# EAGLE design tft_jig (EAGLE 9.3.2)
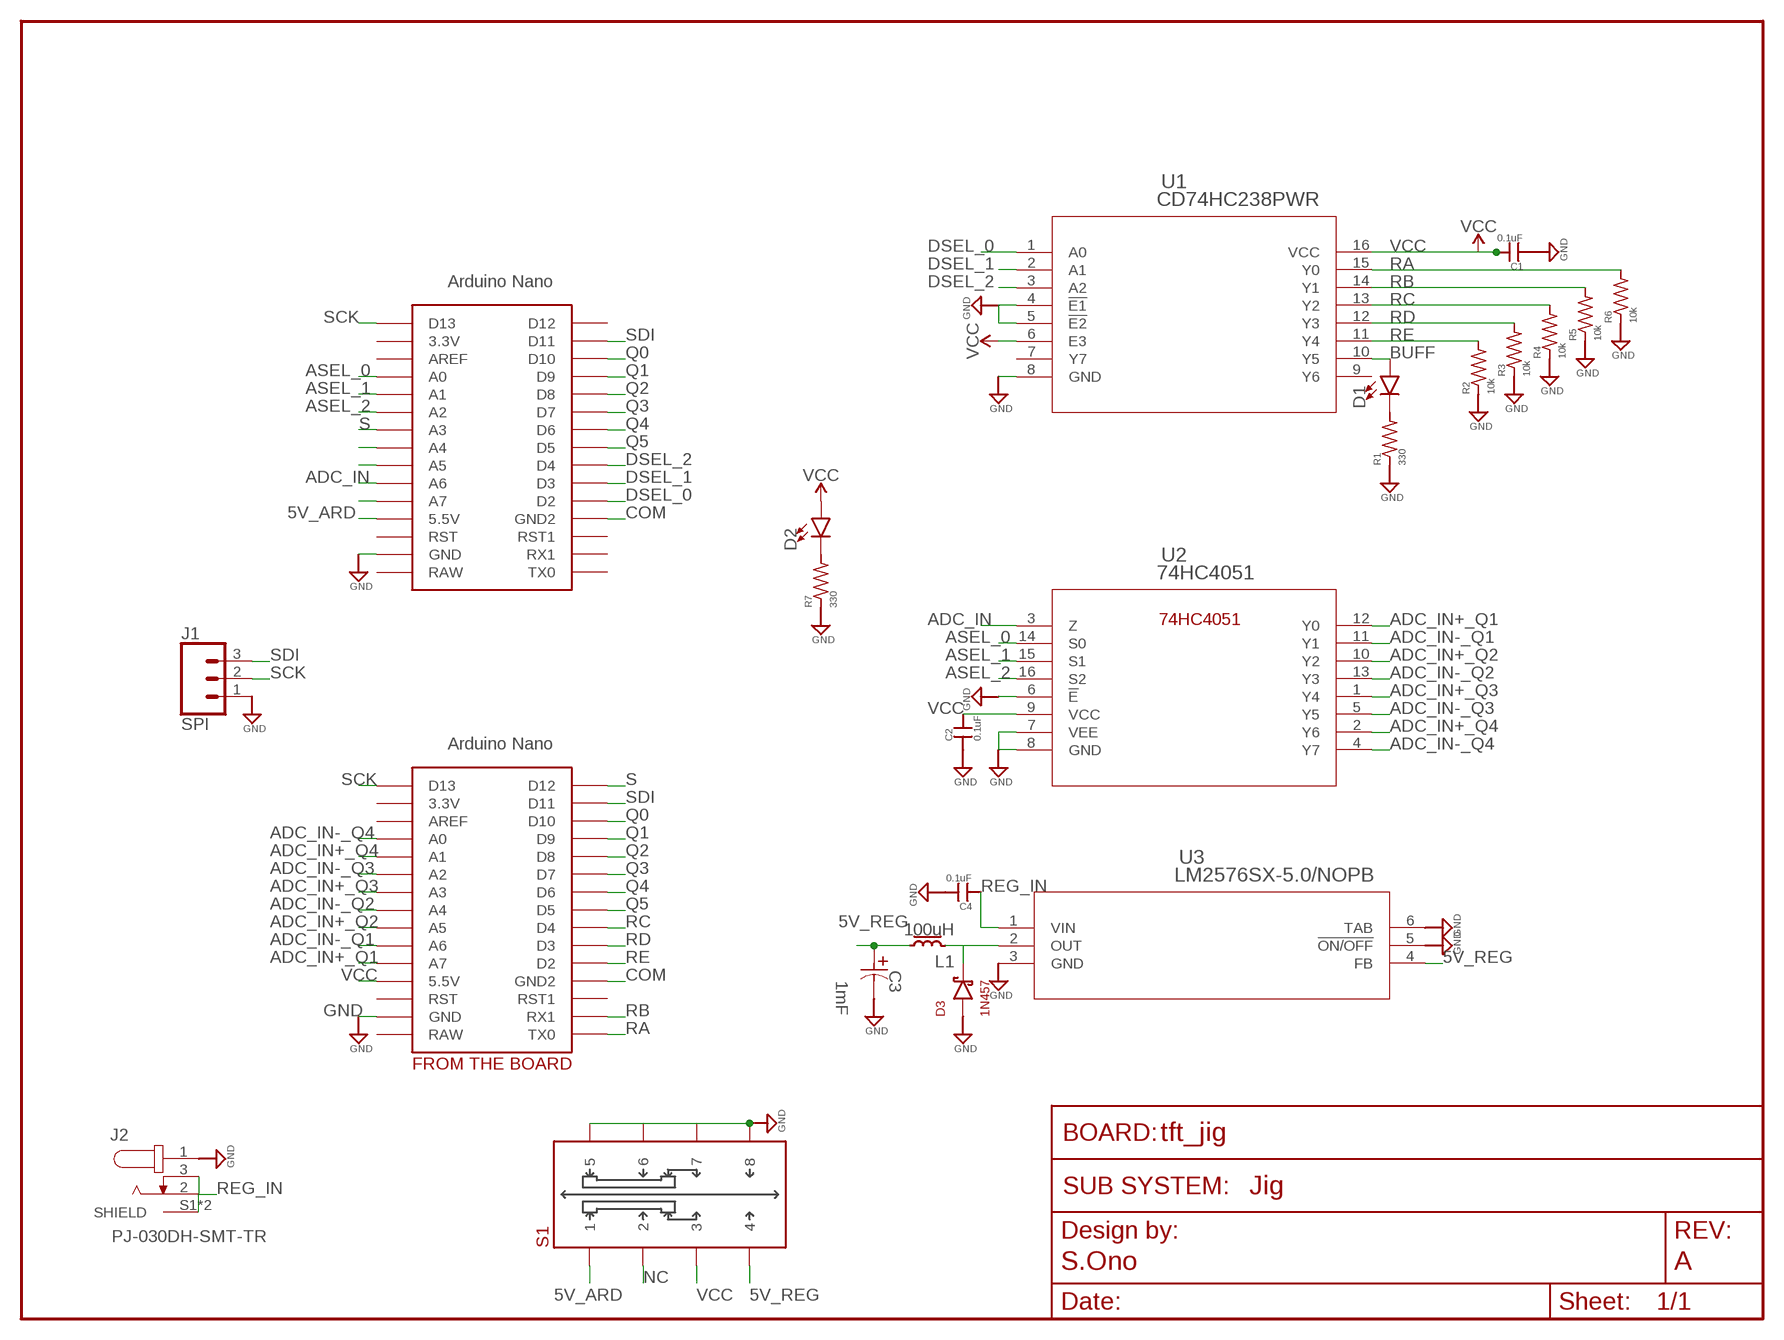
[diagram p0: schematic, sheet 1]
FRAME1 (FRAME_SCHEMATIC): AUTHOR: S.Ono; REV: A; SUBSYSTEM_NAME: Jig

## Parts
C1  0.1uF  CAP0603-CAP  [0603-CAP]
C2  0.1uF  CAP0603-CAP  [0603-CAP]
C3  1mF  UWT0J102MNL1GS  [PCAP_8X10-ELECT]
C4  0.1uF  CAP0603-CAP  [0603-CAP]
D1  LED0603  [LED-0603]
D2  LED0603  [LED-0603]
D3  1N457  [DIODE_THRU]
J1  SPI  CONN_03  [1X03]
J2  PJ-030DH-SMT-TR  [CUI_PJ-030DH-SMT-TR]
L1  100uH  IND  [IND_2012]
R1  330  R-US_R0603  [R0603]
R2  10k  R-US_R0603  [R0603]
R3  10k  R-US_R0603  [R0603]
R4  10k  R-US_R0603  [R0603]
R5  10k  R-US_R0603  [R0603]
R6  10k  R-US_R0603  [R0603]
R7  330  R-US_R0603  [R0603]
S1  DP3T  [DP3T]
U1  CD74HC238PWR  [PW16]
U2  74HC4051  [PW16]
U3  LM2576SX-5.0/NOPB  [TS5B]
U$1  NANO  [NANO]
U$2  NANO  [NANO]

## Nets
5V_ARD: S1.1 U$1.5V(5.5V)
5V_REG: C3.1 L1.1 S1.4 U3.4(FB)
ADC_IN: U2.3(Z) U$1.A6
ADC_IN+_Q1: U2.12(Y0) U$2.A7
ADC_IN+_Q2: U2.10(Y2) U$2.A5
ADC_IN+_Q3: U2.1(Y4) U$2.A3
ADC_IN+_Q4: U2.2(Y6) U$2.A1
ADC_IN-_Q1: U2.11(Y1) U$2.A6
ADC_IN-_Q2: U2.13(Y3) U$2.A4
ADC_IN-_Q3: U2.5(Y5) U$2.A2
ADC_IN-_Q4: U2.4(Y7) U$2.A0
ASEL_0: U2.14(S0) U$1.A0
ASEL_1: U2.15(S1) U$1.A1
ASEL_2: U2.16(S2) U$1.A2
BUFF: D1.A U1.10(Y5)
COM: U$1.GND1(GND2) U$2.GND1(GND2)
DSEL_0: U1.1(A0) U$1.D2
DSEL_1: U1.2(A1) U$1.D3
DSEL_2: U1.3(A2) U$1.D4
GND: C1.1 C2.1 C3.2 C4.2 D3.1(P) J1.1 J2.1 R1.1 R2.1 R3.1 R4.1 R5.1 R6.1 R7.1 S1.5 S1.6 S1.7 S1.8 U1.4(!E1) U1.5(!E2) U1.8(GND) U2.6(!E) U2.7(VEE) U2.8(GND) U3.3(GND) U3.5(!ON/OFF) U3.6(TAB) U$1.GND U$2.GND
N$1: D2.C R7.2
N$2: D3.2(N) L1.2 U3.2(OUT)
N$6: D1.C R1.2
N$35: U$1.A4
N$36: U$1.A5
N$38: U$1.A7
NC: S1.2
Q0: U$1.D10 U$2.D10
Q1: U$1.D9 U$2.D9
Q2: U$1.D8 U$2.D8
Q3: U$1.D7 U$2.D7
Q4: U$1.D6 U$2.D6
Q5: U$1.D5 U$2.D5
RA: R6.2 U1.15(Y0) U$2.TX0
RB: R5.2 U1.14(Y1) U$2.RX1
RC: R4.2 U1.13(Y2) U$2.D4
RD: R3.2 U1.12(Y3) U$2.D3
RE: R2.2 U1.11(Y4) U$2.D2
REG_IN: C4.1 J2.2 J2.3 J2.S1(SHIELD) J2.S2(SHIELD) U3.1(VIN)
S: U$1.A3 U$2.D12
SCK: J1.2 U$1.D13 U$2.D13
SDI: J1.3 U$1.D11 U$2.D11
VCC: C1.2 C2.2 D2.A S1.3 U1.6(E3) U1.16(VCC) U2.9(VCC) U$2.5V(5.5V)
Unconnected: U1.7(Y7) U1.9(Y6) U$1.3.3V U$1.AREF U$1.D12 U$1.RAW U$1.RST U$1.RST1 U$1.RX1 U$1.TX0 U$2.3.3V U$2.AREF U$2.RAW U$2.RST U$2.RST1

## Notes on the sheet
- FROM THE BOARD

## Library data of the parts
C1 C2 C4 = scono:CAP: Capacitor Standard 0603 ceramic capacitor, and 0.1" leaded capacitor.; PIE-INT-REF-NUM: CAPACITOR-GENERIC
C3 = scono:UWT0J102MNL1GS; MANUFACTURER_PART_NUMBER: UWT0J102MNL1GS; VENDOR: Nichicon
D1 D2 = scono:LED: https://www.digikey.com/products/en/optoelectronics/led-indication-discrete/105?k=&pkeyword=&pv7=2&pv1989=0&pv16=5&FV=ffe00069&quantity=0&ColumnSort=0&page=1&pageSize=25
D3 = scono:1N457: https://www.digikey.com/product-detail/en/on-semiconductor/1N457TR/1N457CT-ND/1532749
J1 = scono:CONN_03: Multi connection point. Often used as Generic Header-pin footprint for 0.1 inch spaced/style header connections On any of the 0.1 inch spaced packages, you can populate with these: Break Away Headers - Straight <https://www.sparkfun.com/products/116> (PRT-00116) Break Away Male Headers - Right Angle <https://www.sparkfun.com/products/553> (PRT-00553) Female Headers <https://www.sparkfun.com/products/115> (PRT-00115) Break Away Headers - Machine Pin <https://www.sparkfun.com/products/117> (PRT-00117) Break Away Female Headers - Swiss Machine Pin <https://www.sparkfun.com/products/743> (PRT-00743) Stackable Header - 3 Pin (Female, 0.1") <https://www.sparkfun.com/products/13875> (PRT-13875) For SCREWTERMINALS and SPRING TERMINALS visit here: Screw Terimnals on SparkFun.com <https://www.sparkfun.com/search/results?term=Screw+Terminals> (5mm/3.5mm/2.54mm spacing) This device is also useful as a general connection point to wire up your design to another part of your project. Our various solder wires solder well into these plated through hole pads. Hook-Up Wire - Assortment (Stranded, 22 AWG) <https://www.sparkfun.com/products/11375> (PRT-11375) Hook-Up Wire - Assortment (Solid Core, 22 AWG) <https://www.sparkfun.com/products/11367> (PRT-11367) View the entire wire category on our website here <https://www.sparkfun.com/categories/141> Special notes: Molex polarized connector foot print use with SKU : PRT-08232 with associated crimp pins and housings.
J2 = scono:PJ-030DH-SMT-TR: Conn Power F 2 POS Solder RA SMD 3 Terminal 1 Port T/R; CUI_PURCHASE_URL: https://www.cui.com/product/interconnect/connectors/dc-power-connectors/jacks/pj-030dh-smt-tr?utm_source=snapeda.com&utm_medium=referral&utm_campaign=snapedaBOM; DESCRIPTION: Conn Power F 2 POS Solder RA SMD 3 Terminal 1 Port T/R; DIGI-KEY_PART_NUMBER: CP-030DHPJ-CT-ND; DIGI-KEY_PURCHASE_URL: https://www.digikey.com/product-detail/en/cui-inc/PJ-030DH-SMT-TR/CP-030DHPJ-CT-ND/3587638?utm_source=snapeda&utm_medium=aggregator&utm_campaign=symbol; MF: CUI Inc.; MP: PJ-030DH-SMT-TR; PACKAGE: None
L1 = scono:IND; MANUFACTURER_PART_NUMBER: MLZ2012M1R0HT000; VENDOR: TDK
R1-R7 = scono:R-US_: RESISTOR, American symbol; DESCRIPTION: RESISTOR, American symbol; DISTRIBUTOR: DigiKey; MANUFACTURER: Rohm Semiconductor; NOTES: Cut Tape; PACKAGE: R0603
S1 = scono:DP3T: https://www.digikey.com/product-detail/en/c-k/JS203011JCQN/CKN10725CT-ND/6137639
U1 = scono:CD74HC238PWR; MANUFACTURER_PART_NUMBER: CD74HC238PWR; VENDOR: Vendor
U2 = scono:74HC4051: https://www.digikey.com/product-detail/en/nexperia-usa-inc/74HC4051PW118/1727-3064-1-ND/946721
U3 = scono:LM2576SX-5.0/NOPB; MANUFACTURER_PART_NUMBER: LM2576SX5.0NOPB; VENDOR: Texas Instruments
U$1 U$2 = scono:NANO: Arduino Nano

## Board
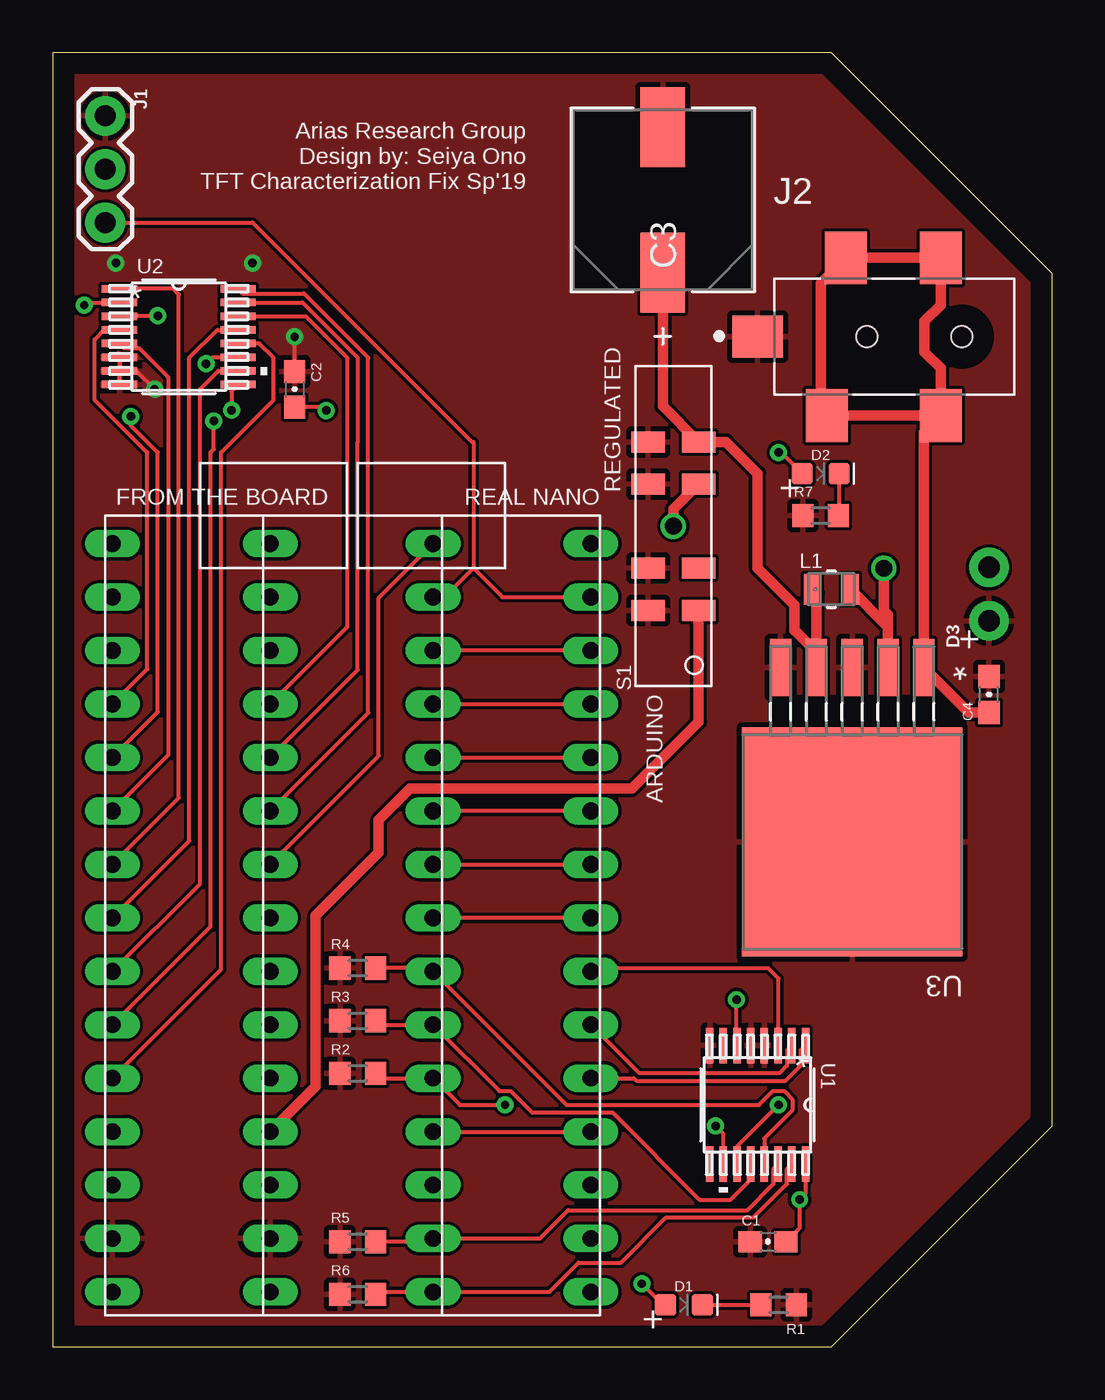
[diagram p1: board, top side]
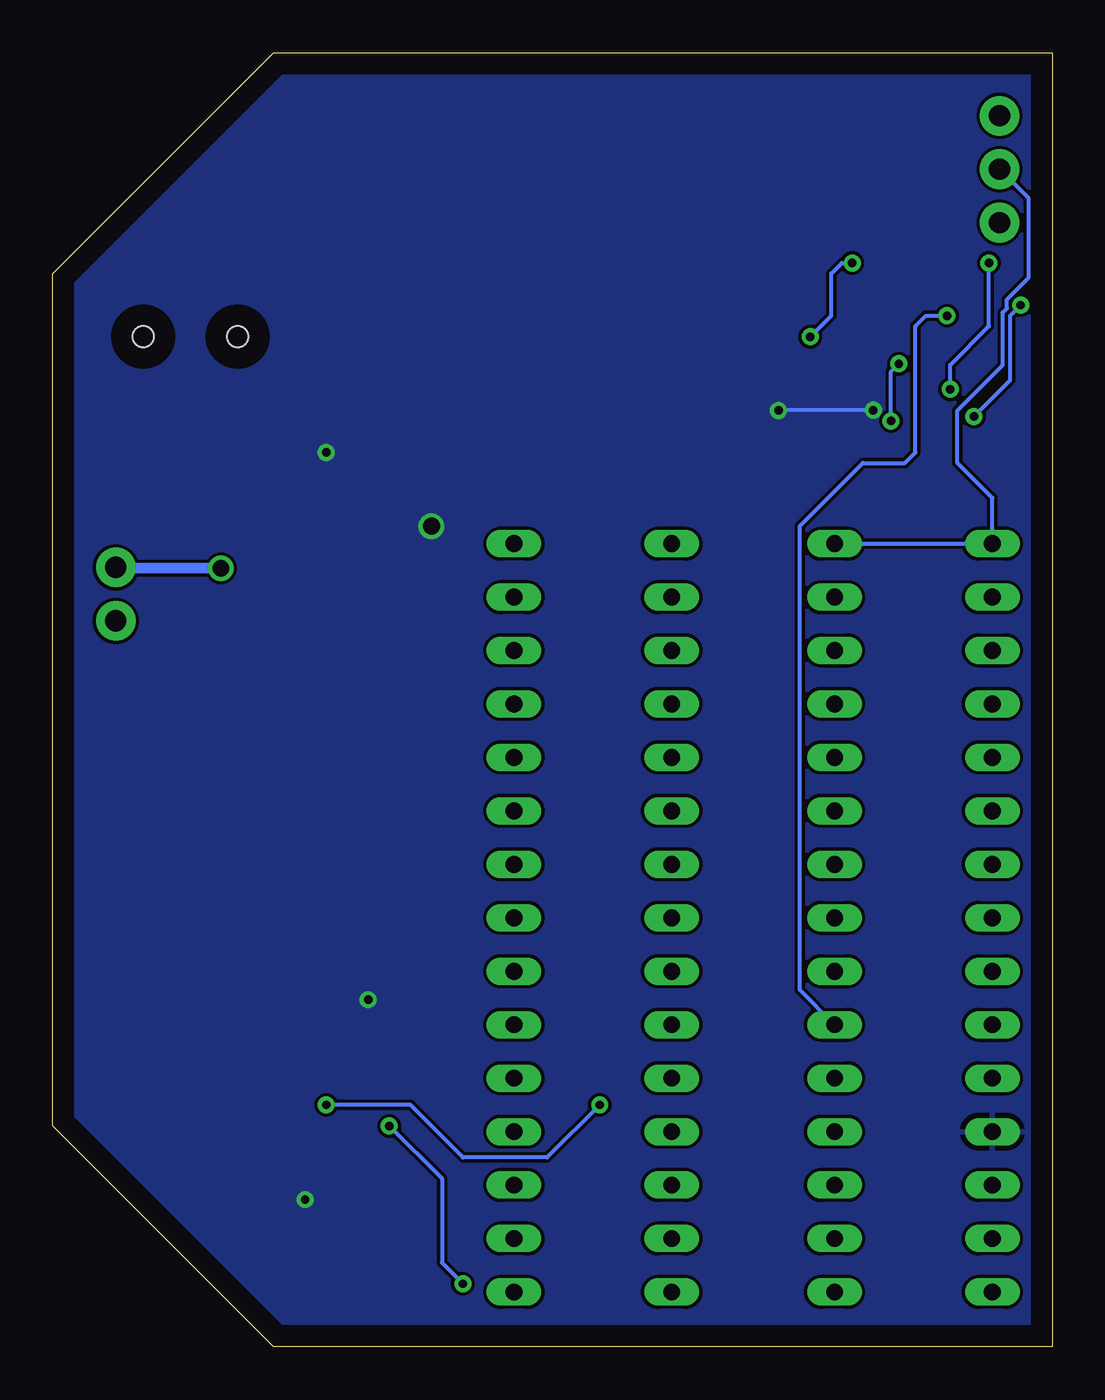
[diagram p2: board, bottom side, seen from below]

Size 47.5 x 61.5 mm. Coordinates in mm from the lower left corner, seen from the top.
Outline: 0,0 37,0 47.5,10.5 47.5,51 37,61.5 0,61.5 0,0
Copper layers (1*16): Top 0.035mm / dielectric 1.5mm / Bottom 0.035mm
Design rules "default": minimum track width 6mil, minimum drill 0.35mm, track to track 6mil, track to pad 6mil, pad to pad 6mil, via to via 6mil, smd to smd 6mil, copper to edge 40mil, drill to drill 6mil, minimum pad ring 10mil, minimum via ring 8mil, stop-mask expansion 4mil, vias tented up to drill 0mil, thermal gap 10mil

### Footprints (pad centres in the part's own frame; a part is rotated, then mirrored left to right if it is on the bottom)
0603-CAP = smd 1.1 x 1: 1 -0.85,0; 2 0.85,0
PCAP_8X10-ELECT = smd 3.81 x 2.108: 1 -3.454,0; 2 3.454,0
LED-0603 = smd 1 x 1: A -0.877,0; C 0.877,0
DIODE_THRU = drill 1.016 pad 1.88: 1 0,0; 2 2.54,0
1X03 = drill 1.016 pad 1.88: 1 0,0; 2 2.54,0; 3 5.08,0
CUI_PJ-030DH-SMT-TR = smd 2.4 x 2: 1 0,0 | smd 2 x 2.5: 2 3.3,-3.75; 3 4.2,3.75; S1 8.7,3.75; S2 8.7,-3.75 | hole 1: 5.2,0; 9.7,0
IND_2012 = smd 0.803 x 1.45: 1 -0.902,0; 2 0.902,0
R0603 = smd 1 x 1.1: 1 -0.85,0; 2 0.85,0
DP3T = smd 1 x 1.6: 1 -4,-1.2; 2 -2,-1.2; 3 2,-1.2; 4 4,-1.2; 5 -4,1.2; 6 -2,1.2; 7 2,1.2; 8 4,1.2
PW16 = smd 1.676 x 0.356: 1 -2.819,2.275; 2 -2.819,1.625; 3 -2.819,0.975; 4 -2.819,0.325; 5 -2.819,-0.325; 6 -2.819,-0.975; 7 -2.819,-1.625; 8 -2.819,-2.275; 9 2.819,-2.275; 10 2.819,-1.625; 11 2.819,-0.975; 12 2.819,-0.325; 13 2.819,0.325; 14 2.819,0.975; 15 2.819,1.625; 16 2.819,2.275
TS5B = smd 1.016 x 2.692: 1 -3.404,-8.28; 2 -1.702,-8.28; 3 0,-8.28; 4 1.702,-8.28; 5 3.404,-8.28 | smd 10.465 x 10.871: 6 0,0
NANO = drill 0.8 long: 3.3V -10.16,24.13; 5V -10.16,-1.27; A0 -10.16,19.05; A1 -10.16,16.51; A2 -10.16,13.97; A3 -10.16,11.43; A4 -10.16,8.89; A5 -10.16,6.35; A6 -10.16,3.81; A7 -10.16,1.27; AREF -10.16,21.59; D2 5.08,1.27; D3 5.08,3.81; D4 5.08,6.35; D5 5.08,8.89; D6 5.08,11.43; D7 5.08,13.97; D8 5.08,16.51; D9 5.08,19.05; D10 5.08,21.59; D11 5.08,24.13; D12 5.08,26.67; D13 -10.16,26.67; GND -10.16,-6.35; GND1 5.08,-1.27; RAW -10.16,-8.89; RST -10.16,-3.81; RST1 5.08,-3.81; RX1 5.08,-6.35; TX0 5.08,-8.89

### Placement (x,y rotation side)
C1  34,5 0 top
C2  11.5,45.5 270 top
C3  29,54.5 90 top
C4  44.5,31 90 top
D1  30,2 0 top
D2  36.5,41.5 0 top
D3  44.5,34.5 90 top
J1  2.5,58.5 270 top
J2  33.5,48 0 top
L1  37,36 0 top
R1  34.5,2 180 top
R2  14.5,13 0 top
R3  14.5,15.5 0 top
R4  14.5,18 0 top
R5  14.5,5 0 top
R6  14.5,2.5 0 top
R7  36.5,39.5 0 top
S1  29.5,39 90 top
U1  33.5,11.5 270 top
U2  6,48 0 top
U3  38,24 180 top
U$1  20.5,11.5 0 top
U$2  13,11.5 0 top

### Tracks (layer width: path | path; a pad name or v marks a point on that pad's centre or on a via)
5V_ARD
  Top 0.5: U$1.5V 12.5,12.39 12.5,20.5 15.5,23.5 15.5,25.04 16.99,26.53 27.53,26.53 30.7,29.7 S1.1
5V_REG
  Top 0.5: C3.1 29,44.7 S1.4 32,43 33.5,41.5 33.5,37 35.25,35.25 35.25,34.05 35.27,34.03 35.51,33.79 36.3,33 | U3.4 36.3,33 | 36.3,33 36.3,35.8 L1.1
ADC_IN  (via drill 0.4)
  Top 0.2: U2.3 3.21,49 v5,49
  Bottom 0.2: U$1.A6 12,16.97 12,39 9,42 7,42 6.5,42.5 6.5,48.5 6,49 v5,49
ADC_IN+_Q1
  Top 0.2: U$2.A7 8,17.93 8,42.5 10.5,45 10.5,47 9.82,47.67 U2.12
ADC_IN+_Q2
  Top 0.2: U$2.A5 7,22.01 7,45.5 7.88,46.38 U2.10
ADC_IN+_Q3
  Top 0.2: U$2.A3 6,26.09 6,50 5.72,50.27 U2.1
ADC_IN+_Q4  (via drill 0.4)
  Top 0.2: U$2.A1 5,30.17 5,42.5 3.71,43.79 v3.71,44.21 | v1.5,49.5 1.62,49.62 U2.2
  Bottom 0.2: v3.71,44.21 2,45.93 2,49 v1.5,49.5
ADC_IN-_Q1  (via drill 0.4)
  Top 0.2: U$2.A6 7.5,19.97 7.5,42.5 7.66,42.66 v7.66,44 | v7.29,46.71 7.6,47.02 U2.11
  Bottom 0.2: v7.66,44 7.66,46.34 v7.29,46.71
ADC_IN-_Q2
  Top 0.2: U$2.A4 6.5,24.05 6.5,47 7.83,48.33 U2.13
ADC_IN-_Q3
  Top 0.2: U$2.A2 5.5,28.13 5.5,46.08 4.12,47.45 3.4,47.45 U2.5
ADC_IN-_Q4
  Top 0.2: U$2.A0 4.5,32.21 4.5,42.5 2,45 2,47.87 2.46,48.33 U2.4
ASEL_0
  Top 0.2: U2.14 12.03,48.98 14,47 14,34.21 U$1.A0
ASEL_1
  Top 0.2: U2.15 11.88,49.62 14.5,47 14.5,43.5 14.5,43 14.5,32.17 U$1.A1
ASEL_2
  Top 0.2: U2.16 9.04,50.05 11.94,50.05 15,47 15,30.13 U$1.A2
BUFF  (via drill 0.4)
  Top 0.2: U1.10 31.88,10.12 v31.5,10.5 | v28,3 29,2 D1.A
  Bottom 0.2: v31.5,10.5 29,8 29,4 v28,3
COM
  Top 0.2: U$2.GND1 U$1.GND1
DSEL_0
  Top 0.2: U$1.D2 27.62,12.77 27.74,12.65 34.83,12.65 35.55,13.38 35.55,14.1 U1.1
DSEL_1
  Top 0.2: U1.2 34.91,14.1 34.91,13.38 34.53,13 27.89,13 U$1.D3
DSEL_2
  Top 0.2: U1.3 34.5,14.34 34.5,17.5 34,18 25.73,18 U$1.D4
GND  (via drill 0.4)
  Top 0.2: U2.7 3.97,46.38 v4.84,45.5 | U2.8 U2.7 | U2.6 U2.7 | C2.1 v11.5,48
  Bottom 0.2: v4.84,45.5 4.84,46.66 3,48.5 v3,51.5 | v11.5,48 10.5,49 10.5,51 10,51.5 v9.5,51.5
  pour Top: 0.5,0.5 37,0.5 47,10.5 47,50.5 36.5,61 0.5,61
N$1
  Top 0.2: R7.2 37.38,39.53 D2.C
N$2  (via drill 0.8)
  Top 0.5: 39.7,34.2 39.7,34.8 39.5,35 v39.5,37 | L1.2 39.7,34.2 | 39.7,34.2 U3.2
  Bottom 0.5: D3.2 44.46,37 v39.5,37
N$6
  Top 0.2: D1.C R1.2
Q0
  Top 0.2: U$1.D10 U$2.D10
Q1
  Top 0.2: U$2.D9 U$1.D9
Q2
  Top 0.2: U$2.D8 U$1.D8
Q3
  Top 0.2: U$1.D7 U$2.D7
Q4
  Top 0.2: U$2.D6 U$1.D6
Q5
  Top 0.2: U$1.D5 U$2.D5
RA
  Top 0.2: R6.2 15.46,2.61 U$2.TX0 23.61,2.61 25,4 27,4 29.15,6.15 33.31,6.15 34.91,7.74 34.91,8.46 U1.15
RB
  Top 0.2: R5.2 17.93,5 U$2.RX1 23.15,5.15 24.5,6.5 33.02,6.5 34.26,7.74 34.26,8.46 U1.14
RC
  Top 0.2: R4.2 17.93,18 U$2.D4 24.43,11.5 33.57,11.5 34.23,12.16 34.77,12.16 35.16,11.77 35.16,11.23 33.83,9.9 U1.13
RD
  Top 0.2: R3.2 15.54,15.31 U$2.D3 21.23,12.16 21.77,12.16 22.79,11.14 26.61,11.14 30.75,7 32.22,7 33.17,7.96 U1.12
RE  (via drill 0.4)
  Top 0.2: R2.2 15.58,12.77 U$2.D2 19.35,11.5 v21.5,11.5 | v34.5,11.5 32.52,9.53 U1.11
  Bottom 0.2: v21.5,11.5 24,9 28,9 30.5,11.5 v34.5,11.5
REG_IN
  Top 0.5: C4.1 43.53,30.15 U3.1 41.4,43.45 J2.S2 | J2.S2 J2.2 36.5,44.55 36.5,50.55 J2.3 J2.S1 42.2,49.5 41.43,48.73 41.43,47.27 42.2,46.5 J2.S2
S
  Top 0.2: U$1.A3 15.5,28.09 15.5,35.59 U$2.D12
SCK
  Bottom 0.2: U$1.D13 U$2.D13 2.84,40.34 4.5,42 4.5,44.5 2.35,46.65 2.35,49.15 2.16,49.34 2.16,49.77 1.12,50.81 1.12,54.58 J1.2
SDI
  Top 0.2: J1.3 9.5,53.42 19.92,43 20,43 20,37 | 20,37 21.37,35.63 U$1.D11 | 20,37 18.63,35.63 U$2.D11
VCC  (via drill 0.4, 0.8)
  Top 0.2: U2.9 8.51,45.41 v8.51,44.51 | v13,44.5 12.85,44.65 C2.2 | U1.16 35.77,7.28 v35.5,7 35.5,5.65 C1.2 | D2.A 34.62,42.5 v34.5,42.5 | U1.6 32.5,14.34 v32.5,16.5
  Top 0.5: S1.3 29.5,39.8 v29.5,39
  Bottom 0.2: v8.51,44.51 v12.99,44.51 v13,44.5
  pour Bottom: 0.5,61 36.5,61 47,50.5 47,10.5 37,0.5 0.5,0.5

### Text on the board
tPlace: Arias Research Group / Design by: Seiya Ono / TFT Characterization Fix Sp'19 | REGULATED | FROM THE BOARD | REAL NANO | ARDUINO